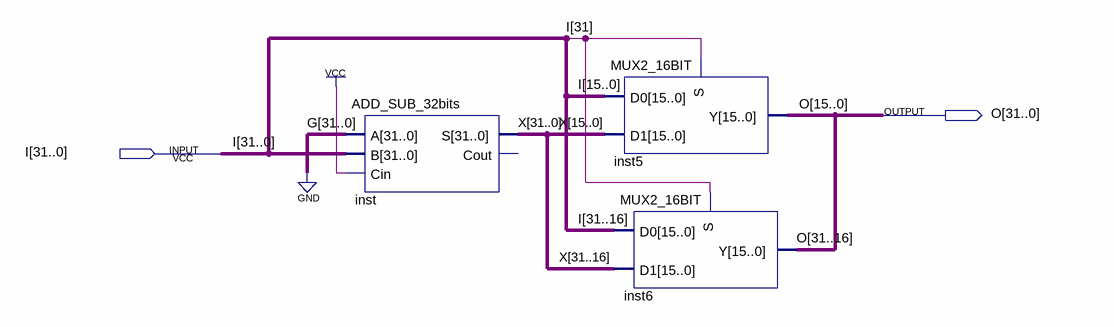
[diagram p0: schematic sheet]
// Quartus schematic trans_32bits.bdf as structural Verilog: 3 symbols, 2 pins
module trans_32bits (
  input  [31:0] I,
  output [31:0] O
);

  wire [31:0] X;

  ADD_SUB_32bits inst (.A({32{1'b0}}), .B(I), .Cin(1'b1), .S(X));  // open: Cout
  MUX2_16BIT inst5 (.S(I[31]), .D1(X[15:0]), .D0(I[15:0]), .Y(O[15:0]));
  MUX2_16BIT inst6 (.S(I[31]), .D1(X[31:16]), .D0(I[31:16]), .Y(O[31:16]));
endmodule
